# Altium schematic sheet ESP32_TRIGGER_AUDIO_SCHEMATIC.SchDoc
size A; SheetNumber: 1; SheetTotal: 1
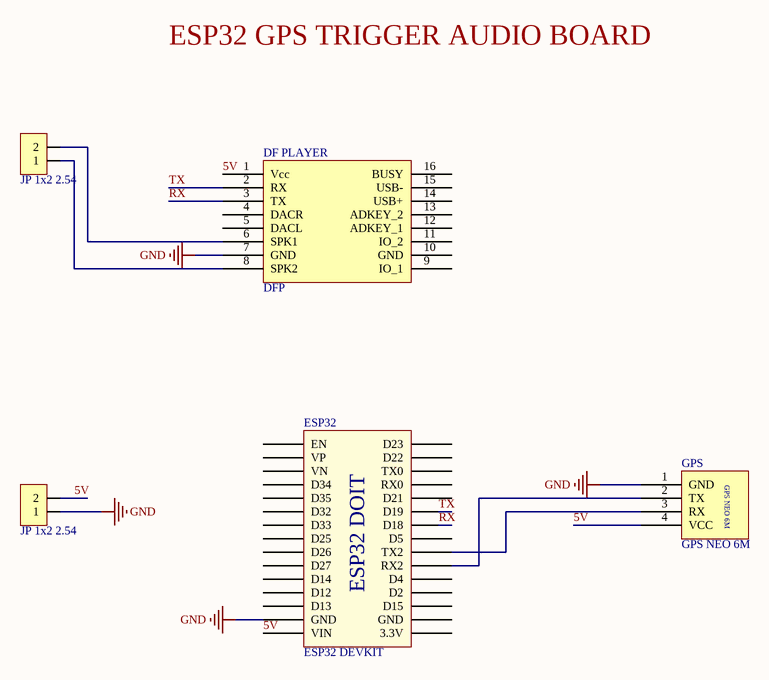
[diagram p0: ESP32_TRIGGER_AUDIO_SCHEMATIC.SchDoc]

## Parts
DF_PLAYER  DFP  [DFPlayer]
ESP32  ESP32 DEVKIT  [ESP32 WROOM 32 KIT - duplicate]
GPS  GPS NEO 6M  [GPS NEO 6M]
JP1  JP 1x2 2.54  [JP 1x2 DT]
JP2  JP 1x2 2.54  [JP 1x2 DT]

## Nets
GND: DF_PLAYER.7(GND) ESP32.14(GND) GPS.1(GND) JP1.1
5V: DF_PLAYER.1(Vcc) ESP32.15(VIN) GPS.4(VCC) JP1.2
RX: DF_PLAYER.3(TX) ESP32.24(D18)
TX: DF_PLAYER.2(RX) ESP32.25(D19)
NetDF_PLAYER_6: DF_PLAYER.6(SPK1) JP2.2
NetDF_PLAYER_8: DF_PLAYER.8(SPK2) JP2.1
NetESP32_21: ESP32.21(RX2) GPS.2(TX)
NetESP32_22: ESP32.22(TX2) GPS.3(RX)

Not connected (* = marked no-connect by the designer): DF_PLAYER 4(DACR) 5(DACL) 9(IO_1) 10(GND) 11(IO_2) 12(ADKEY_1) 13(ADKEY_2) 14(USB+) 15(USB-) 16(BUSY); ESP32 1(EN) 2(VP) 3(VN) 4(D34) 5(D35) 6(D32) 7(D33) 8(D25) 9(D26) 10(D27) 11(D14) 12(D12) 13(D13) 16(3.3V) 17(GND) 18(D15) 19(D2) 20(D4) 23(D5) 26(D21) 27(RX0) 28(TX0) 29(D22) 30(D23)

## Notes on the sheet
- ESP32 GPS TRIGGER AUDIO BOARD
- (in symbol ESP32 WROOM 32 KIT) ESP32 DOIT

## Library data of the parts
DF_PLAYER = DFPlayer
ESP32 = ESP32 WROOM 32 KIT
JP1 JP2 = JP 1x2 2.54 Duc Thang: Cắm; Ten_Linh_Kien: Jump Đơn Đực 2.54MM 1x40P Thẳng 11MM; Don_Vi: Con; Ma_Hang: MH000903; Ghi_Chu: *; Kieu_Chan: *; Chung_Loai: Cắm